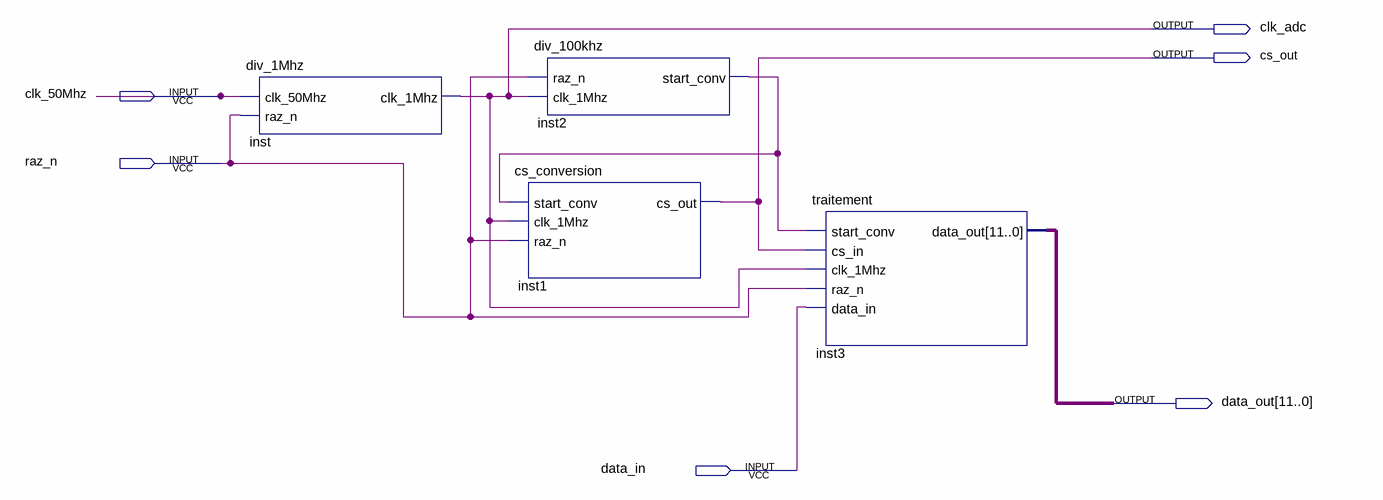
[diagram p0: schematic sheet]
// Quartus schematic traitement_verin.bdf as structural Verilog: 4 symbols, 6 pins
module traitement_verin (
  input  clk_50Mhz,
  input  raz_n,
  input  data_in,
  output clk_adc,
  output cs_out,
  output [11:0] data_out
);

  wire inst2_start_conv;

  div_1Mhz inst (.clk_50Mhz(clk_50Mhz), .raz_n(raz_n), .clk_1Mhz(clk_adc));
  div_100khz inst2 (.raz_n(raz_n), .clk_1Mhz(clk_adc), .start_conv(inst2_start_conv));
  cs_conversion inst1 (.start_conv(inst2_start_conv), .clk_1Mhz(clk_adc), .raz_n(raz_n), .cs_out(cs_out));
  traitement inst3 (
    .start_conv(inst2_start_conv), .cs_in(cs_out), .clk_1Mhz(clk_adc), .raz_n(raz_n), .data_in(data_in),
    .data_out(data_out));
endmodule
